# Altium project baseboardV0.1.PrjPCB
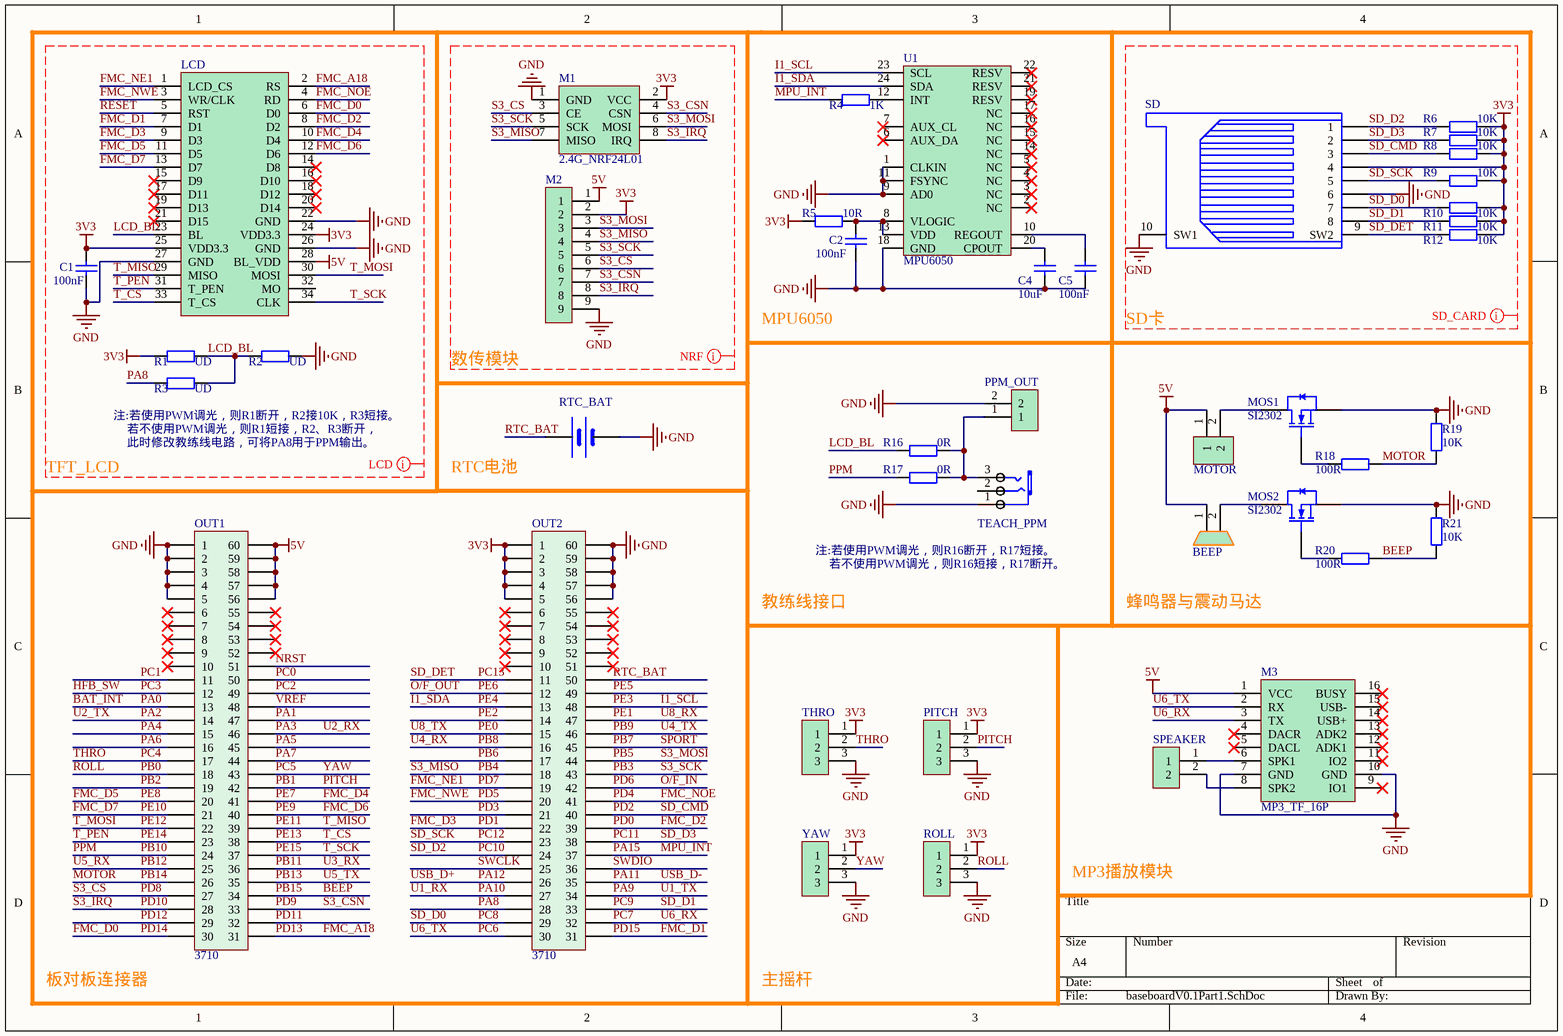
[diagram p0: baseboardV0.1Part1.SchDoc]
2 sheets, 129 parts. Net scope: global (net labels, ports and power ports of the same name join across sheets).
Board file: baseboardV0.1.PcbDoc
Sheets:
  baseboardV0.1Part1.SchDoc
  baseboardV0.1Part2.SchDoc

## Sheet baseboardV0.1Part1.SchDoc
size A4

### Parts
BEEP  BEEP_5020_SMT  [BEEP_5020_SMT]  (value not drawn)
C1  100nF  [0603_C]
C2  100nF  [0603_C]
C4  10uF  [0603_C]
C5  100nF  [0603_C]
LCD  LCD_3.5_480*320_SMT  [LCD_3.5_480*320_SMT]  (value not drawn)
M1  2.4G_NRF24L01  [2.4G_NRF24L01]
M2  SH1.25mm_9P  [SH1.25MM_9P]  (value not drawn)
M3  MP3_TF_16P  [MP3_TF_16P]
MOS1  SI2302  [SOT23]
MOS2  SI2302  [SOT23]
MOTOR  SH1.25mm_2P  [SH1.25mm_2P]  (value not drawn)
OUT1  3710  [3710F060046G3FT01]
OUT2  3710  [3710F060046G3FT01]
PITCH  pitch  [SH1.25mm_3P]  (value not drawn)
PPM_OUT  SH1.25mm_2P  [SH1.25mm_2P]  (value not drawn)
R1  UD  [0603_R]
R2  UD  [0603_R]
R3  UD  [0603_R]
R4  1K  [0603_R]
R5  10R  [0603_R]
R6  10K  [0603_R]
R7  10K  [0603_R]
R8  10K  [0603_R]
R9  10K  [0603_R]
R10  10K  [0603_R]
R11  10K  [0603_R]
R12  10K  [0603_R]
R16  0R  [0603_R]
R17  0R  [0603_R]
R18  100R  [0603_R]
R19  10K  [0603_R]
R20  100R  [0603_R]
R21  10K  [0603_R]
ROLL  roll  [SH1.25mm_3P]  (value not drawn)
RTC_BAT  CR1220_BATTERY  [CR1220_BATTERY]  (value not drawn)
SD  TF_Card  [TF_card]  (value not drawn)
SPEAKER  SH1.25mm_2P  [SH1.25mm_2P]  (value not drawn)
TEACH_PPM  AUDIO_PJ313D  [AUDIO_PJ313D]  (value not drawn)
THRO  thro  [SH1.25mm_3P]  (value not drawn)
U1  MPU6050  [QFN24]
YAW  yaw  [SH1.25mm_3P]  (value not drawn)

### Nets
3V3: C1.2 LCD.24(VDD3.3) LCD.25(VDD3.3) M1.2(VCC) M2.2 OUT2.1 OUT2.2 OUT2.3 OUT2.4 OUT2.5 PITCH.1 R1.1 R5.1 R6.2 R7.2 R8.2 R9.2 R10.2 R11.2 R12.2 ROLL.1 SD.4 THRO.1 YAW.1
5V: BEEP.1 LCD.28(BL_VDD) M2.1 M3.1(VCC) MOTOR.1 OUT1.56 OUT1.57 OUT1.58 OUT1.59 OUT1.60
GND: C1.1 C2.1 C4.2 C5.2 LCD.22(GND) LCD.26(GND) LCD.27(GND) M1.1(GND) M2.9 M3.7(GND) M3.10(GND) MOS1.2(S) MOS2.2(S) OUT1.1 OUT1.2 OUT1.3 OUT1.4 OUT1.5 OUT2.56 OUT2.57 OUT2.58 OUT2.59 OUT2.60 PITCH.3 PPM_OUT.2 R2.2 R19.2 R21.2 ROLL.3 RTC_BAT.2(GND) SD.6 SD.10(SW1) TEACH_PPM.1(COM) THRO.3 U1.1(CLKIN) U1.9(AD0) U1.11(FSYNC) U1.18(GND) YAW.3
BAT_INT: OUT1.13  [also labelled PA0]
BEEP: OUT1.34 R20.2 R21.1  [also labelled PB15]
FMC_A18: LCD.2(RS) OUT1.31  [also labelled PD13]
FMC_D0: LCD.6(D0) OUT1.30  [also labelled PD14]
FMC_D1: LCD.7(D1) OUT2.31  [also labelled PD15]
FMC_D2: LCD.8(D2) OUT2.39  [also labelled PD0]
FMC_D3: LCD.9(D3) OUT2.22  [also labelled PD1]
FMC_D4: LCD.10(D4) OUT1.41  [also labelled PE7]
FMC_D5: LCD.11(D5) OUT1.20  [also labelled PE8]
FMC_D6: LCD.12(D6) OUT1.40  [also labelled PE9]
FMC_D7: LCD.13(D7) OUT1.21  [also labelled PE10]
FMC_NE1: LCD.1(LCD_CS) OUT2.19  [also labelled PD7]
FMC_NOE: LCD.4(RD) OUT2.41  [also labelled PD4]
FMC_NWE: LCD.3(WR/CLK) OUT2.20  [also labelled PD5]
HFB_SW: OUT1.12  [also labelled PC3]
I1_SCL: OUT2.48 U1.23(SCL)  [also labelled PE3]
I1_SDA: OUT2.13 U1.24(SDA)  [also labelled PE4]
LCD_BL: LCD.23(BL) R1.2 R2.1 R3.2 R16.2
MOTOR: OUT1.26 R18.2 R19.1  [also labelled PB14]
MPU_INT: OUT2.37 R4.1  [also labelled PA15]
NRST: OUT1.51
O/F_IN: OUT2.42  [also labelled PD6]
O/F_OUT: OUT2.12  [also labelled PE6]
PA1: OUT1.47
PA2: OUT1.14  [also labelled U2_TX]
PA3: OUT1.46  [also labelled U2_RX]
PA4: OUT1.15
PA5: OUT1.45
PA6: OUT1.16
PA7: OUT1.44
PA8: OUT2.28 R3.1
PA9: OUT2.34  [also labelled U1_TX]
PA10: OUT2.27  [also labelled U1_RX]
PA11: OUT2.35  [also labelled USB_D-]
PA12: OUT2.26  [also labelled USB_D+]
PB0: OUT1.18 ROLL.2  [also labelled ROLL]
PB1: OUT1.42 PITCH.2  [also labelled PITCH]
PB2: OUT1.19
PB3: M1.5(SCK) M2.5 OUT2.43  [also labelled S3_SCK]
PB4: M1.7(MISO) M2.4 OUT2.18  [also labelled S3_MISO]
PB5: M1.6(MOSI) M2.3 OUT2.44  [also labelled S3_MOSI]
PB6: OUT2.17
PB7: OUT2.45  [also labelled SPORT]
PB8: OUT2.16  [also labelled U4_RX]
PB9: OUT2.46  [also labelled U4_TX]
PB10: OUT1.24 R17.2  [also labelled PPM]
PB11: OUT1.36  [also labelled U3_RX]
PB12: OUT1.25  [also labelled U5_RX]
PB13: OUT1.35  [also labelled U5_TX]
PC0: OUT1.50
PC1: OUT1.11
PC2: OUT1.49
PC4: OUT1.17 THRO.2  [also labelled THRO]
PC5: OUT1.43 YAW.2  [also labelled YAW]
PC6: M3.2(RX) OUT2.30  [also labelled U6_TX]
PC7: M3.3(TX) OUT2.32  [also labelled U6_RX]
PC8: OUT2.29 R10.1 SD.7  [also labelled SD_D0]
PC9: OUT2.33 R11.1 SD.8  [also labelled SD_D1]
PC10: OUT2.24 R6.1 SD.1  [also labelled SD_D2]
PC11: OUT2.38 R7.1 SD.2  [also labelled SD_D3]
PC12: OUT2.23 R9.1 SD.5  [also labelled SD_SCK]
PC13: OUT2.11 R12.1 SD.9(SW2)  [also labelled SD_DET]
PD2: OUT2.40 R8.1 SD.3  [also labelled SD_CMD]
PD3: OUT2.21
PD8: M1.3(CE) M2.6 OUT1.27  [also labelled S3_CS]
PD9: M1.4(CSN) M2.7 OUT1.33  [also labelled S3_CSN]
PD10: M1.8(IRQ) M2.8 OUT1.28  [also labelled S3_IRQ]
PD11: OUT1.32
PD12: OUT1.29
PE0: OUT2.15  [also labelled U8_TX]
PE1: OUT2.47  [also labelled U8_RX]
PE2: OUT2.14
PE5: OUT2.49
PE11: LCD.29(MISO) OUT1.39  [also labelled T_MISO]
PE12: LCD.30(MOSI) OUT1.22  [also labelled T_MOSI]
PE13: LCD.33(T_CS) OUT1.38  [also labelled T_CS]
PE14: LCD.31(T_PEN) OUT1.23  [also labelled T_PEN]
PE15: LCD.34(CLK) OUT1.37  [also labelled T_SCK]
RESET: LCD.5(RST)
RTC_BAT: OUT2.50 RTC_BAT.1(VCC)
SWCLK: OUT2.25
SWDIO: OUT2.36
VREF: OUT1.48
NetBEEP_2: BEEP.2 MOS2.3(D)
NetC2_2: C2.2 R5.2 U1.8(VLOGIC) U1.13(VDD)
NetC4_1: C4.1 U1.20(CPOUT)
NetC5_1: C5.1 U1.10(REGOUT)
NetM3_6: M3.6(SPK1) SPEAKER.1
NetM3_8: M3.8(SPK2) SPEAKER.2
NetMOS1_1: MOS1.1(G) R18.1
NetMOS1_3: MOS1.3(D) MOTOR.2
NetMOS2_1: MOS2.1(G) R20.1
NetPPM_OUT_1: PPM_OUT.1 R16.1 R17.1 TEACH_PPM.3(CHL)
NetR4_2: R4.2 U1.12(INT)

Not connected (* = marked no-connect by the designer): LCD 14(D8)* 15(D9)* 16(D10)* 17(D11)* 18(D12)* 19(D13)* 20(D14)* 21(D15)* 32(MO); M3 4(DACR)* 5(DACL)* 9(IO1)* 11(IO2)* 12(ADK1)* 13(ADK2)* 14(USB+)* 15(USB-)* 16(BUSY)*; OUT1 6* 7* 8* 9* 10* 52* 53* 54* 55*; OUT2 6* 7* 8* 9* 10* 51* 52* 53* 54* 55*; TEACH_PPM 2(CHR); U1 2(NC)* 3(NC)* 4(NC)* 5(NC)* 6(AUX_DA)* 7(AUX_CL)* 14(NC)* 15(NC)* 16(NC)* 17(NC)* 19(RESV)* 21(RESV)* 22(RESV)*

### Layout directives
net class LCD: 3V3, 5V, FMC_A18, FMC_D0, FMC_D1, FMC_D2, FMC_D3, FMC_D4, FMC_D5, FMC_D6, FMC_D7, FMC_NE1, FMC_NOE, FMC_NWE, GND, LCD_BL, PA8, RESET, T_CS, T_MISO, T_MOSI, T_PEN, T_SCK
net class SD_CARD: 3V3, GND, SD_CMD, SD_D0, SD_D1, SD_D2, SD_D3, SD_DET, SD_SCK
net class NRF: 3V3, 5V, GND, S3_CS, S3_CSN, S3_IRQ, S3_MISO, S3_MOSI, S3_SCK

### Notes on the sheet
- 数传模块
- MPU6050
- SD卡
- (near R3) 注:若使用PWM调光，则R1断开，R2接10K，R3短接。
- (near R3) 若不使用PWM调光，则R1短接，R2、R3断开，
- 此时修改教练线电路，可将PA8用于PPM输出。
- TFT_LCD
- RTC电池
- 注:若使用PWM调光，则R16断开，R17短接。
- 若不使用PWM调光，则R16短接，R17断开。
- 教练线接口
- 蜂鸣器与震动马达
- MP3播放模块
- 板对板连接器
- 主摇杆

### Library data of the parts
C1 C2 C4 C5 = 0603_CAP
MOS1 MOS2 = MOSN_SI2302_SOT23
OUT1 OUT2 = 3710F_30*2pin
PITCH ROLL THRO YAW = SH1.25mm_3P
R1-R12 R16-R21 = 0603_RES

## Sheet baseboardV0.1Part2.SchDoc
size A4
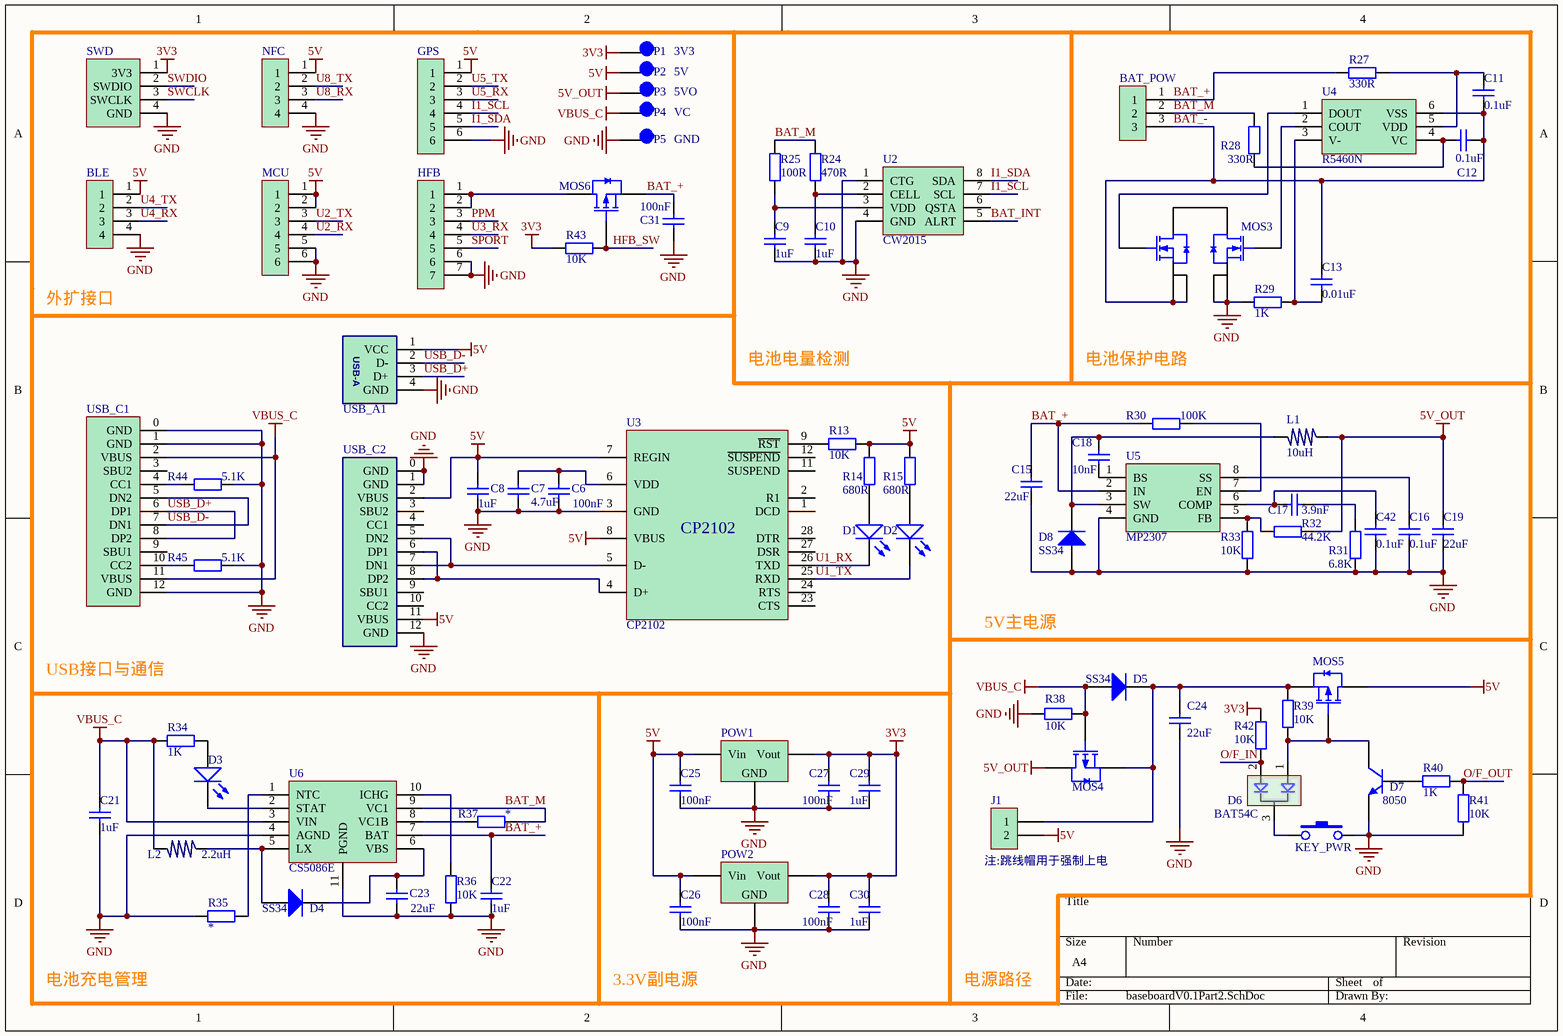
[diagram p1: baseboardV0.1Part2.SchDoc]

### Parts
BAT_POW  XH2.54_3P_SMT_T  [XH2.54_3P_SMT_L]  (value not drawn)
BLE  SH1.25mm_4P  [SH1.25MM_4P]  (value not drawn)
C6  100nF  [0603_C]
C7  4.7uF  [0805_C]
C8  1uF  [0603_C]
C9  1uF  [0603_C]
C10  1uF  [0603_C]
C11  0.1uF  [0603_C]
C12  0.1uF  [0603_C]
C13  0.01uF  [0603_C]
C15  22uF  [0805_C]
C16  0.1uF  [0603_C]
C17  3.9nF  [0603_C]
C18  10nF  [0603_C]
C19  22uF  [0805_C]
C21  1uF  [0603_C]
C22  1uF  [0603_C]
C23  22uF  [0805_C]
C24  22uF  [0805_C]
C25  100nF  [0603_C]
C26  100nF  [0603_C]
C27  100nF  [0603_C]
C28  100nF  [0603_C]
C29  1uF  [0603_C]
C30  1uF  [0603_C]
C31  100nF  [0603_C]
C42  0.1uF  [0603_C]
D1  0805_LED  [0805_LED]  (value not drawn)
D2  0805_LED  [0805_LED]  (value not drawn)
D3  0805_LED  [0805_LED]  (value not drawn)
D4  SS34  [DO214_SMC]
D5  SS34  [DO214_SMC]
D6  BAT54C  [BAT54C]
D7  8050  [SOT23]
D8  SS34  [DO214_SMC]
GPS  SH1.25mm_6P  [SH1.25MM_6P]  (value not drawn)
HFB  SH1.25mm_7P  [SH1.25MM_7P]  (value not drawn)
J1  Header_2.54_2P  [HDR1_2P]  (value not drawn)
KEY_PWR  KEY_S_6*6  [KEY_S_6*6]  (value not drawn)
L1  10uH  [0630_L]
L2  2.2uH  [0630_L]
MCU  SH1.25mm_6P  [SH1.25MM_6P]  (value not drawn)
MOS3  MOSN_8205A_TSSOP8  [TSSOP-8]  (value not drawn)
MOS4  MOSP_AO4419_SOIC8  [SOIC8_MOS]  (value not drawn)
MOS5  MOSP_AO4419_SOIC8  [SOIC8_MOS]  (value not drawn)
MOS6  MOSP_AO4419_SOIC8  [SOIC8_MOS]  (value not drawn)
MTSWD  SWD  [MT_SWD_1]
NFC  SH1.25mm_4P  [SH1.25MM_4P]  (value not drawn)
P1  3V3  [TEST_POINT_2mm]
P2  5V  [TEST_POINT_2mm]
P3  5VO  [TEST_POINT_2mm]
P4  VC  [TEST_POINT_2mm]
P5  GND  [TEST_POINT_2mm]
POW1  AMS1117_3.3  [SOT223]  (value not drawn)
POW2  AMS1117_3.3  [SOT223]  (value not drawn)
R13  10K  [0603_R]
R14  680R  [0603_R]
R15  680R  [0603_R]
R24  470R  [0603_R]
R25  100R  [0603_R]
R27  330R  [0603_R]
R28  330R  [0603_R]
R29  1K  [0603_R]
R30  100K  [0603_R]
R31  6.8K  [0603_R]
R32  44.2K  [0603_R]
R33  10K  [0603_R]
R34  1K  [0603_R]
R35  *  [0603_R]
R36  10K  [0603_R]
R37  *  [0603_R]
R38  10K  [0603_R]
R39  10K  [0603_R]
R40  1K  [0603_R]
R41  10K  [0603_R]
R42  10K  [0603_R]
R43  10K  [0603_R]
R44  5.1K  [0603_R]
R45  5.1K  [0603_R]
U2  CW2015  [CW2015_TDFN]
U3  CP2102  [QFN28]
U4  R5460N  [SOT_23_6]
U5  MP2307  [SOIC8N]
U6  CS5086E  [ESOP10L]
USB_A1  USB_A_SMT  [USB_A_SMT]  (value not drawn)
USB_C1  USB_C_16P_SMT  [USB_C_16PIN_SMT]  (value not drawn)
USB_C2  USB_C_16P_SMT  [USB_C_16PIN_SMT]  (value not drawn)

### Nets
3V3: C27.2 C28.2 C29.2 C30.2 MTSWD.1(3V3) P1.1 POW1.2(Vout) POW2.2(Vout) R42.2 R43.2
5V: BLE.1 C8.2 C25.2 C26.2 GPS.1 J1.2 MCU.1 MCU.2 MOS5.2(D) NFC.1 P2.1 POW1.3(Vin) POW2.3(Vin) R13.2 R14.2 R15.2 U3.7(REGIN) U3.8(VBUS) USB_A1.1(VCC) USB_C2.2(VBUS) USB_C2.11(VBUS)
5V_OUT: C19.2 L1.1 MOS4.2(D) P3.1 R32.2
GND: BLE.4 C6.1 C7.2 C8.1 C9.1 C10.1 C15.1 C16.2 C19.1 C21.1 C22.1 C23.1 C24.1 C25.1 C26.1 C27.1 C28.1 C29.1 C30.1 C31.1 C42.2 D7.2(E) D8.1(A) GPS.6 HFB.6 HFB.7 KEY_PWR.2 MCU.5 MCU.6 MOS3.6(S2) MOS3.7(S2) MTSWD.4(GND) NFC.4 P5.1 POW1.1(GND) POW2.1(GND) R29.2 R31.1 R33.1 R35.1 R36.2 R38.1 R41.1 R44.1 R45.1 U2.1(CTG) U2.4(GND) U3.3(GND) U5.4(GND) U6.4(AGND) U6.11(PGND) USB_A1.4(GND) USB_C1.0(GND) USB_C1.1(GND) USB_C1.12(GND) USB_C2.0(GND) USB_C2.1(GND) USB_C2.12(GND)
VBUS_C: C21.2 D5.1(A) L2.2 MOS4.1(G) P4.1 R34.1 R38.2 U6.3(VIN) USB_C1.2(VBUS) USB_C1.11(VBUS)
BAT_+: BAT_POW.1 C15.2 C22.2 C31.2 MOS6.3(S) R27.2 R30.2 U5.2(IN) U6.7(BAT)
BAT_-: BAT_POW.3 C11.1 C12.1 C13.2 MOS3.2(S1) MOS3.3(S1) U4.6(VSS)
BAT_INT: U2.5(ALRT)
BAT_M: BAT_POW.2 R24.1 R25.1 R28.2 R37.2 U6.9(VC1)
HFB_SW: MOS6.1(G) R43.1
I1_SCL: GPS.4 U2.7(SCL)
I1_SDA: GPS.5 U2.8(SDA)
O/F_IN: D6.2 R42.1
O/F_OUT: R40.1 R41.2
PPM: HFB.3  [project net PB10]
SPORT: HFB.5  [project net PB7]
SWCLK: MTSWD.3(SWCLK)
SWDIO: MTSWD.2(SWDIO)
U1_RX: D1.K U3.26(TXD)  [project net PA10]
U1_TX: D2.K U3.25(RXD)  [project net PA9]
U2_RX: MCU.4  [project net PA3]
U2_TX: MCU.3  [project net PA2]
U3_RX: HFB.4  [project net PB11]
U4_RX: BLE.3  [project net PB8]
U4_TX: BLE.2  [project net PB9]
U5_RX: GPS.3  [project net PB12]
U5_TX: GPS.2  [project net PB13]
U8_RX: NFC.3  [project net PE1]
U8_TX: NFC.2  [project net PE0]
USB_D+: USB_A1.3(D+) USB_C1.6(DP1) USB_C1.8(DP2)  [project net PA12]
USB_D-: USB_A1.2(D-) USB_C1.5(DN2) USB_C1.7(DN1)  [project net PA11]
NetC6_2: C6.2 C7.1 U3.6(VDD)
NetC9_2: C9.2 R25.2 U2.3(VDD)
NetC10_2: C10.2 R24.2 U2.2(CELL)
NetC11_2: C11.2 R27.1 U4.5(VDD)
NetC12_2: C12.2 R28.1 U4.4(VC)
NetC13_1: C13.1 R29.1 U4.3(V-)
NetC16_1: C16.1 U5.8(SS)
NetC17_1: C17.1 C42.1 U5.6(COMP)
NetC17_2: C17.2 R31.2
NetC18_1: C18.1 D8.2(K) L1.2 U5.3(SW)
NetC18_2: C18.2 U5.1(BS)
NetC23_2: C23.2 D4.2(K) U6.6(VBS)
NetC24_2: C24.2 D5.2(K) J1.1 MOS4.3(S) MOS5.3(S) R39.2
NetD1_A: D1.A R14.1
NetD2_A: D2.A R15.1
NetD3_A: D3.A R34.2
NetD3_K: D3.K U6.2(STAT)
NetD4_1: D4.1(A) L2.1 U6.5(LX)
NetD6_1: D6.1 D7.3(C) MOS5.1(G) R39.1
NetD6_3: D6.3 KEY_PWR.1
NetD7_1: D7.1(B) R40.2
NetHFB_1: HFB.1 HFB.2 MOS6.2(D)
NetMOS3_4: MOS3.4(G1) U4.1(DOUT)
NetMOS3_5: MOS3.5(G2) U4.2(COUT)
NetR13_1: R13.1 U3.9(~{RST})
NetR30_1: R30.1 U5.7(EN)
NetR32_1: R32.1 R33.2 U5.5(FB)
NetR35_2: R35.2 U6.1(NTC)
NetR36_1: R36.1 U6.10(ICHG)
NetR37_1: R37.1 U6.8(VC1B)
NetR44_2: R44.2 USB_C1.4(CC1)
NetR45_2: R45.2 USB_C1.10(CC2)
NetU3_4: U3.4(D+) USB_C2.6(DP1) USB_C2.8(DP2)
NetU3_5: U3.5(D-) USB_C2.5(DN2) USB_C2.7(DN1)

Not connected (* = marked no-connect by the designer): MOS3 1(D1) 8(D2); U2 6(QSTA); U3 1(DCD) 2(R1) 11(SUSPEND) 12(~{SUSPEND}) 23(CTS) 24(RTS) 27(DSR) 28(DTR); USB_C1 3(SBU2) 9(SBU1); USB_C2 3(SBU2) 4(CC1) 9(SBU1) 10(CC2)

### Notes on the sheet
- 外扩接口
- 电池电量检测
- 电池保护电路
- 5V主电源
- USB接口与通信
- (near J1) 注:跳线帽用于强制上电
- 电池充电管理
- 3.3V副电源
- 电源路径
- (in symbol USB_A_SMT) USB-A

### Library data of the parts
C6 C8-C13 C16-C18 C21 C22 C25-C31 C42 = 0603_CAP
C7 C15 C19 C23 C24 = 0805_CAP
D4 D5 D8 = SS34_DO214
D7 = NPN_SS8050_SOT23
L1 L2 = 0630_L
MTSWD = MT_SWD_1
P1-P5 = TEST_POINT_2mm
R13-R15 R24 R25 R27-R45 = 0603_RES
U2 = CW2015_TDFN
U3 = CP2102_QFN28
U4 = R5460N: 2-CELL PROTECTOR

## Nets that join several sheets
3V3: baseboardV0.1Part1 (24 pins), baseboardV0.1Part2 (10 pins)
5V: baseboardV0.1Part1 (10 pins), baseboardV0.1Part2 (21 pins)
GND: baseboardV0.1Part1 (39 pins), baseboardV0.1Part2 (58 pins)
BAT_INT: baseboardV0.1Part1 (OUT1.13), baseboardV0.1Part2 (U2.5)
HFB_SW: baseboardV0.1Part1 (OUT1.12), baseboardV0.1Part2 (MOS6.1 R43.1)
I1_SCL: baseboardV0.1Part1 (OUT2.48 U1.23), baseboardV0.1Part2 (GPS.4 U2.7)
I1_SDA: baseboardV0.1Part1 (OUT2.13 U1.24), baseboardV0.1Part2 (GPS.5 U2.8)
O/F_IN: baseboardV0.1Part1 (OUT2.42), baseboardV0.1Part2 (D6.2 R42.1)
O/F_OUT: baseboardV0.1Part1 (OUT2.12), baseboardV0.1Part2 (R40.1 R41.2)
PA2: baseboardV0.1Part1 (OUT1.14), baseboardV0.1Part2 (MCU.3)
PA3: baseboardV0.1Part1 (OUT1.46), baseboardV0.1Part2 (MCU.4)
PA9: baseboardV0.1Part1 (OUT2.34), baseboardV0.1Part2 (D2.K U3.25)
PA10: baseboardV0.1Part1 (OUT2.27), baseboardV0.1Part2 (D1.K U3.26)
PA11: baseboardV0.1Part1 (OUT2.35), baseboardV0.1Part2 (USB_A1.2 USB_C1.5 USB_C1.7)
PA12: baseboardV0.1Part1 (OUT2.26), baseboardV0.1Part2 (USB_A1.3 USB_C1.6 USB_C1.8)
PB7: baseboardV0.1Part1 (OUT2.45), baseboardV0.1Part2 (HFB.5)
PB8: baseboardV0.1Part1 (OUT2.16), baseboardV0.1Part2 (BLE.3)
PB9: baseboardV0.1Part1 (OUT2.46), baseboardV0.1Part2 (BLE.2)
PB10: baseboardV0.1Part1 (OUT1.24 R17.2), baseboardV0.1Part2 (HFB.3)
PB11: baseboardV0.1Part1 (OUT1.36), baseboardV0.1Part2 (HFB.4)
PB12: baseboardV0.1Part1 (OUT1.25), baseboardV0.1Part2 (GPS.3)
PB13: baseboardV0.1Part1 (OUT1.35), baseboardV0.1Part2 (GPS.2)
PE0: baseboardV0.1Part1 (OUT2.15), baseboardV0.1Part2 (NFC.2)
PE1: baseboardV0.1Part1 (OUT2.47), baseboardV0.1Part2 (NFC.3)
SWCLK: baseboardV0.1Part1 (OUT2.25), baseboardV0.1Part2 (MTSWD.3)
SWDIO: baseboardV0.1Part1 (OUT2.36), baseboardV0.1Part2 (MTSWD.2)